# EAGLE schematic hamp1 (EAGLE 6.1)
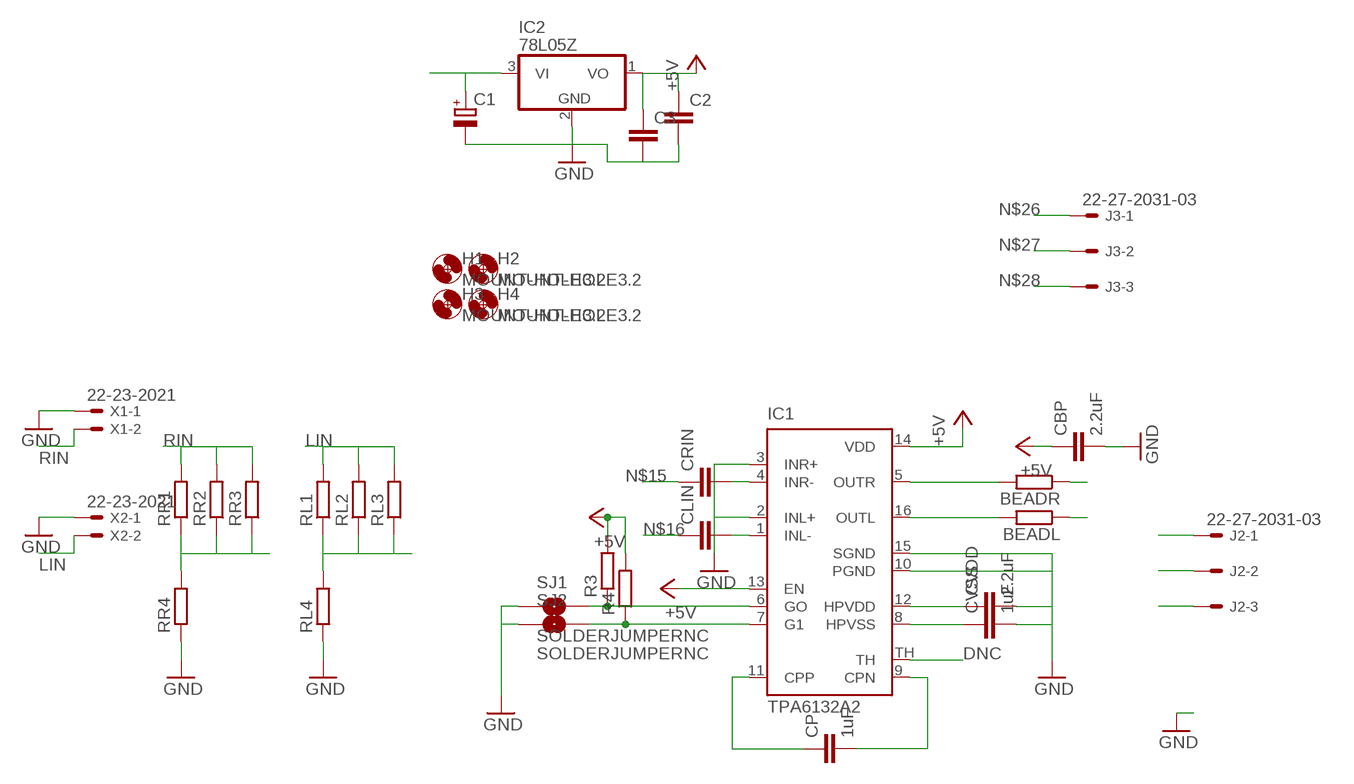
[diagram p0: schematic, sheet 1]

## Parts
BEADL  R-EU_R0805  [R0805]
BEADR  R-EU_R0805  [R0805]
C1  CPOL-EUF  [PANASONIC_F]
C2  C-EUC1210  [C1210]
C3  C-EUC0805  [C0805]
CBP  2.2uF  C-EUC0805  [C0805]
CLIN  C-EU050-055X075  [C050-055X075]
CP  1uF  C-EUC0805  [C0805]
CRIN  C-EU050-055X075  [C050-055X075]
CVDD  2.2uF  C-EUC0805  [C0805]
CVSS  1uF  C-EUC0805  [C0805]
H1  MOUNT-HOLE3.2  [3,2]
H2  MOUNT-HOLE3.2  [3,2]
H3  MOUNT-HOLE3.2  [3,2]
H4  MOUNT-HOLE3.2  [3,2]
IC1  TPA6132A2  [QFN16]
IC2  78L05Z  [TO92]
J2  22-27-2031-03  [6410-03]
J3  22-27-2031-03  [6410-03]
R3  R-EU_R0805  [R0805]
R4  R-EU_R0805  [R0805]
RL1  R-EU_R0805  [R0805]
RL2  R-EU_R0805  [R0805]
RL3  R-EU_R0805  [R0805]
RL4  R-EU_R0805  [R0805]
RR1  R-EU_R0805  [R0805]
RR2  R-EU_R0805  [R0805]
RR3  R-EU_R0805  [R0805]
RR4  R-EU_R0805  [R0805]
SJ1  SOLDERJUMPERNC  [SJ_2S]
SJ2  SOLDERJUMPERNC  [SJ_2S]
X1  22-23-2021  [22-23-2021]
X2  22-23-2021  [22-23-2021]

## Nets
+5V: C2.1 C3.1 CBP.1 IC1.13(EN) IC1.14(VDD) IC2.1(VO) R3.2 R4.2
DNC: IC1.TH
GND: C1.- C2.2 C3.2 CBP.2 CVDD.2 CVSS.2 IC1.2(INL+) IC1.3(INR+) IC1.10(PGND) IC1.15(SGND) IC2.2(GND) J2.1 RL4.1 RR4.1 SJ1.1 SJ2.1 X1.1 X2.1
LIN: RL1.2 RL2.2 RL3.2 X2.2
N$1: CVDD.1 IC1.12(HPVDD)
N$2: CRIN.2 IC1.4(INR-)
N$3: CLIN.2 IC1.1(INL-)
N$4: IC1.6(GO) R3.1 SJ1.2
N$5: IC1.7(G1) R4.1 SJ2.2
N$6: BEADR.1 J2.2
N$7: CP.1 IC1.11(CPP)
N$8: CP.2 IC1.9(CPN)
N$9: CVSS.1 IC1.8(HPVSS)
N$10: BEADR.2 IC1.5(OUTR)
N$11: BEADL.2 IC1.16(OUTL)
N$14: BEADL.1 J2.3
N$15: CRIN.1 RR1.1 RR2.1 RR3.1 RR4.2
N$16: CLIN.1 RL1.1 RL2.1 RL3.1 RL4.2
N$17: C1.+ IC2.3(VI)
N$26: J3.1
N$27: J3.2
N$28: J3.3
RIN: RR1.2 RR2.2 RR3.2 X1.2

## Library data of the parts
BEADL BEADR R3 R4 RL1-RL4 RR1-RR4 = rcl:R-EU_: RESISTOR, European symbol
C1 = rcl:CPOL-EU: POLARIZED CAPACITOR, European symbol
C2 C3 CBP CP CVDD CVSS = resistor:C-EU: CAPACITOR, European symbol
CLIN CRIN = rcl:C-EU: CAPACITOR, European symbol
H1-H4 = holes:MOUNT-HOLE: MOUNTING HOLE with drill center marker
IC1 = texas:TPA6132A2: 25-mW DIRECTPATH (TM) STEREO HEADPHONE AMPLIFIER WITH POP SUPPRESSION Source: www.ti.com .. tpa6132a2 direct path stereo $.65.pdf; MPN: TPA6132A2RTET; OC_FARNELL: 1697167; OC_NEWARK: 46P3781
IC2 = adafruit:78*: Positive VOLTAGE REGULATOR Added bigger pads to the TO-92 package
J2 J3 = con-molex:22-?-03: CONNECTOR wire to board 2.54 mm (.1 inch) pitch header; OC_FARNELL: unknown; OC_NEWARK: unknown
SJ1 SJ2 = SparkFun-Passives:SOLDERJUMPER: Solder Jumper Standard SMD solder jumper. Used to automate production. Two varients : Normally Open and Normally Closed are the same, but have different paste layers. NC will have a large amount of paste and should jumper during reflow.
X1 X2 = con-molex:22-23-2021: .100" (2.54mm) Center Header - 2 Pin; MF: MOLEX; MPN: 22-23-2021; OC_FARNELL: 1462926; OC_NEWARK: 25C3832